# EasyEDA Pro project ProPrj_RS485 to TTL Converter_2026-02-25.epro

# Schematic Schematic1

## Sheets
1 Power Supply: Board Name: Board1; Create Date: 2026-02-10; Page Name: Power Supply; Project Name: RS485 to TTL Converter; Schematic Name: Schematic1; Update Date: 2026-02-10; Company: EasyEDA.com; Page Size: A4; Version: V1.0
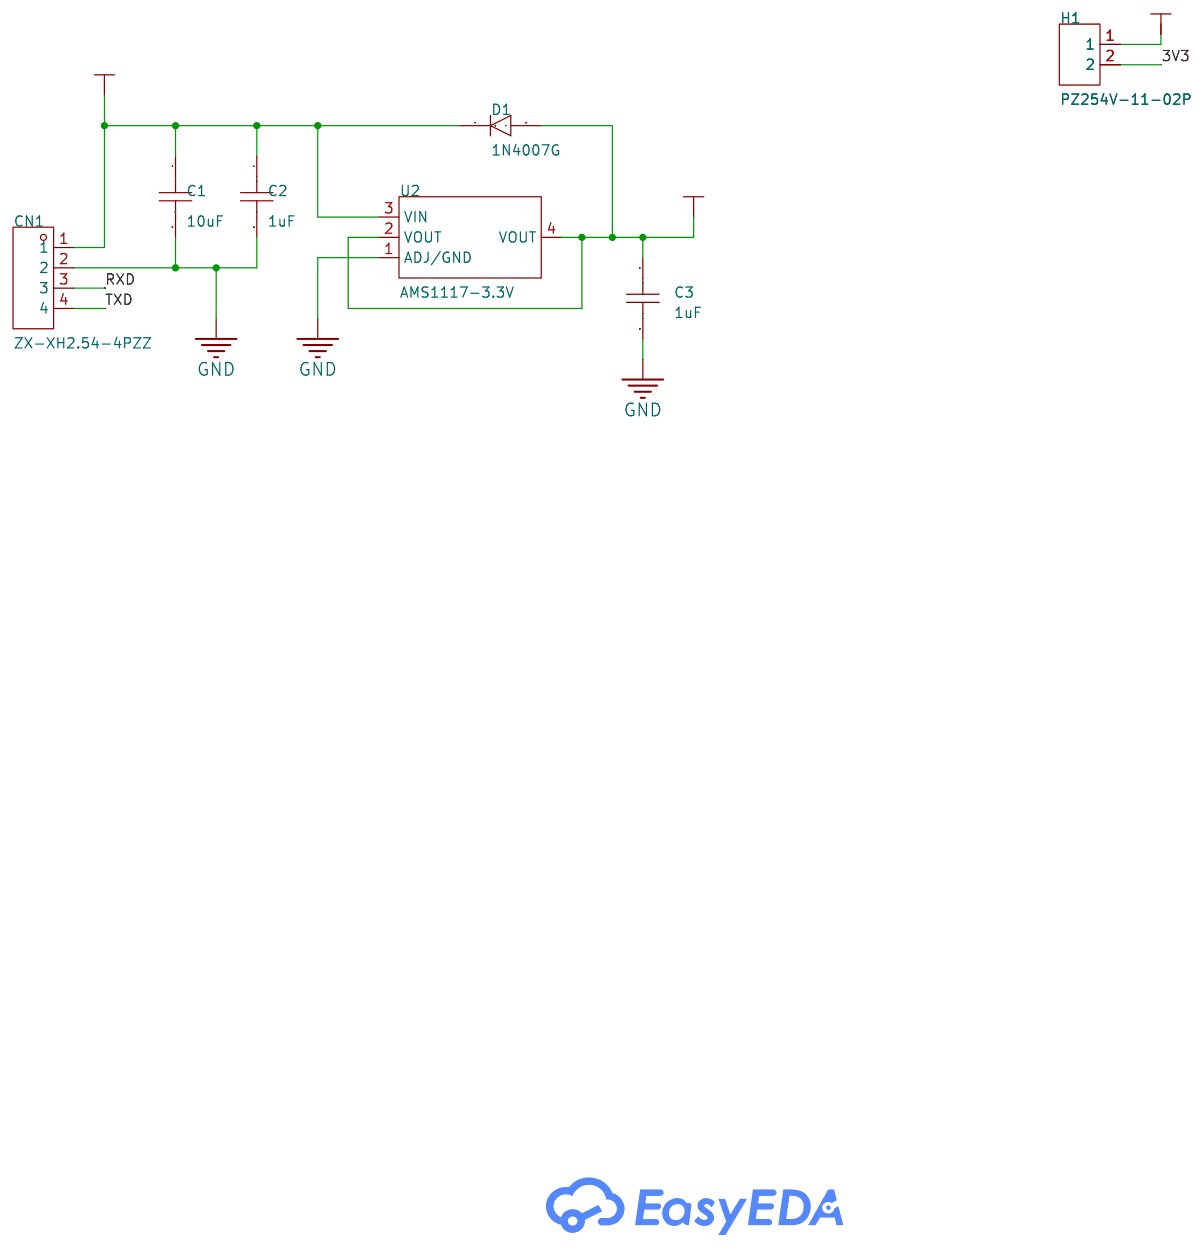
[diagram p0: Power Supply]
2 RS485: Page Name: RS485
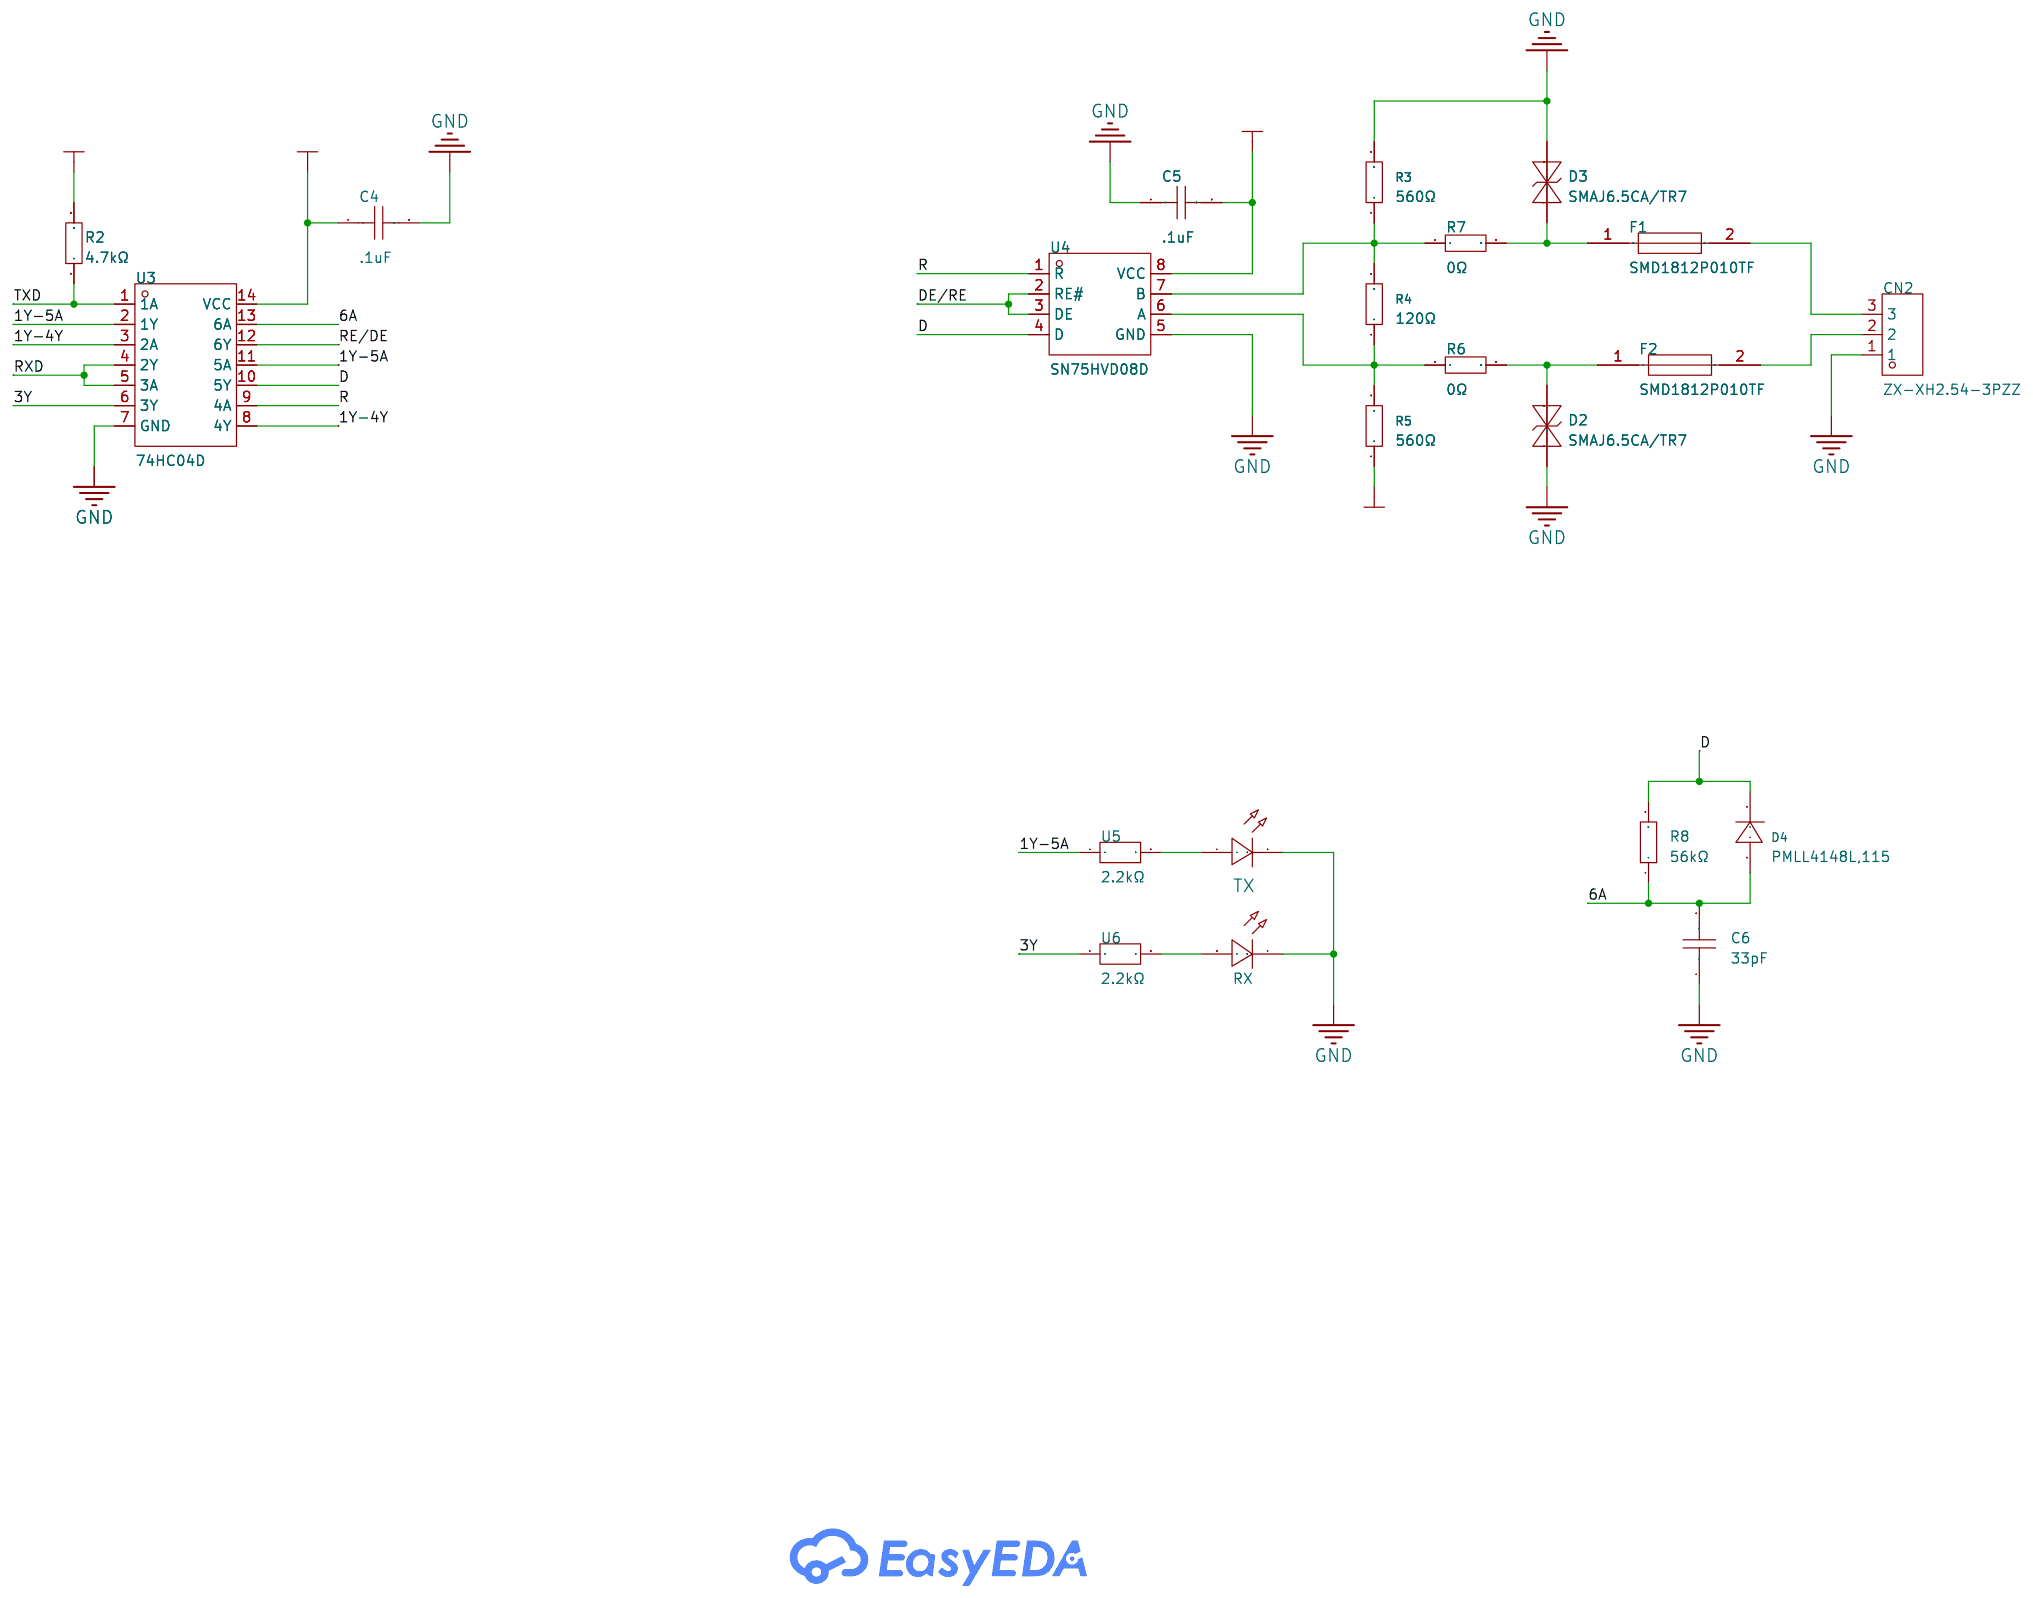
[diagram p1: RS485]

## Parts
sheet Power Supply
C1  10uF  [C0603]
C2  1uF  [C0603]
C3  1uF  [C0603]
CN1  ZX-XH2.54-4PZZ  [CONN-TH_4P-P2.50_4PIN]
D1  1N4007G  [SMA_L4.4-W2.6-LS5.0-RD]
H1  PZ254V-11-02P  [HDR-TH_2P-P2.54-V-M]
U2  AMS1117-3.3V  [SOT-223-4_L6.5-W3.5-P2.30-LS7.0-BR]
sheet RS485
C4  .1uF  [C0603]
C5  .1uF  [C0603]
C6  33pF  [C0603]
CN2  ZX-XH2.54-3PZZ  [CONN-TH_3P-P2.54_2501S-3P]
D2  SMAJ6.5CA/TR7  [SMA_L4.3-W2.6-LS5.1-BI]
D3  SMAJ6.5CA/TR7  [SMA_L4.3-W2.6-LS5.1-BI]
D4  PMLL4148L,115  [SOD-80_L3.5-W1.5-RD]
F1  SMD1812P010TF  [F1812]
F2  SMD1812P010TF  [F1812]
R2  4.7kΩ  [R0805]
R3  560Ω  [R0805]
R4  120Ω  [R0805]
R5  560Ω  [R0805]
R6  0Ω  [R0805]
R7  0Ω  [R0805]
R8  56kΩ  [R0805]
RX  -  [LED0603-RD_GREEN]
TX  -  [LED0603-R-RD]
U3  74HC04D  [SOP-14_L8.6-W3.9-P1.27-LS6.0-BL]
U4  SN75HVD08D  [SOIC-8_L4.9-W3.9-P1.27-LS6.0-BL]
U5  2.2kΩ  [R0805]
U6  2.2kΩ  [R0805]

## Library data of the parts
C1-C6 = CAP_0603: Supplier Footprint: 0603
CN1 = ZX-XH2.54-4PZZ: Pins Structure:1x4P Pitch:2.5mm Mounting Type:Through Hole Reference Series:XH Number of Pins:4P Number of Rows:1 Number of PINs Per Row:4 Row Spacing:- Current Rating:3A Contact Material:Brass Contact Plating:Tin Operating Temperature:-25℃~+85℃ Operating; LCSC Part Name: 1x4P 间距:2.5mm 直插 系列:XH; Supplier Part: C7429634; Manufacturer: Megastar(兆星); Supplier Footprint: 插件,P=2.5mm; JLCPCB Part Class: Extended Part; Datasheet: https://item.szlcsc.com/datasheet/ZX-XH2.54-4PZZ/8427551.html; Supplier: LCSC; Pins Structure: 1x4P; Pitch: 2.5mm; Mounting Type: Through Hole; Reference Series: XH; Number of Pins: 4P; Number of Rows: 1; Number of PINs Per Row: 4; Current Rating: 3A; Contact Material: Brass; Contact Plating: Tin; Operating Temperature: -25℃~+85℃; Voltage Rating: 250V; Plastic Material: PA66; Flame Retardant Rating: UL94V-0; Color: White; Z-Height of the Board: 7mm; X-Length of Bottom Edge on Board (Spacing Line): 12.5mm; Y-Width of Bottom Edge on Board: 5.9mm
D1 = 1N4007G_C111122: Diode Configuration:Independent Voltage - Forward(Vf@If):1.1V@1A Voltage - DC Reverse(Vr):1kV Current - Rectified:1A Reverse Leakage Current (Ir):5uA@1kV; LCSC Part Name: 丝印M7 1kV 1A; Supplier Part: C111122; Manufacturer: SHIKUES(时科); Supplier Footprint: SMA(DO-214AC); JLCPCB Part Class: Extended Part; Datasheet: https://item.szlcsc.com/datasheet/1N4007G/112348.html; Supplier: LCSC; Diode Configuration: Independent; Voltage - Forward(Vf@If): 1.1V@1A; Voltage - DC Reverse(Vr): 1kV; Current - Rectified: 1A; Reverse Leakage Current (Ir): 5uA@1kV
H1 = PZ254V-11-02P: Pin Structure:1x2P Pitch:2.54mm Row Spacing:- Circluar Pins/Square Pins:Pin Header Mounting Type:Through Hole Number of Rows:1 Number of Pins:2P Current Rating:- Voltage Rating (Max):- Length of Mating Pin:6mm Insulation Height:2.5mm Length of End Connect; LCSC Part Name: 1x2P 间距:2.54mm 方针 直插; Supplier Part: C492401; Manufacturer: XFCN(兴飞); Supplier Footprint: 插件,P=2.54mm; JLCPCB Part Class: Extended Part; Datasheet: https://item.szlcsc.com/datasheet/PZ254V-11-02P/502957.html; Supplier: LCSC; Pin Structure: 1x2P; Pitch: 2.54mm; Circluar Pins/Square Pins: Pin Header; Mounting Type: Through Hole; Number of Rows: 1; Number of Pins: 2P; Length of Mating Pin: 6mm; Insulation Height: 2.5mm; Length of End Connection Pin: 3mm; Contact Material: Brass; Operating Temperature: -40℃~+105℃; Color: Black
U2 = AMS1117-3.3V_C2688239: Output Type:Fixed Voltage - Supply:12V Output Voltage:3.3V Output Voltage:3.3V Output Current:1A Power Supply Rejection Ratio (PSRR):70dB@(120Hz) Voltage Dropout:1.4V@(1A) standby current:5mA Noise:0.003%Vout Features:Over Temperature Protection；Thermal S; LCSC Part Name: 输入20V 输出3.3V 1A; Supplier Part: C2688239; Manufacturer: WPMtek(维攀); Supplier Footprint: SOT-223-3L; JLCPCB Part Class: Extended Part; Datasheet: https://item.szlcsc.com/datasheet/AMS1117-3.3V/2793377.html; Supplier: LCSC; Output Type: Fixed; Voltage - Supply: 12V; Output Voltage: 3.3V; Output Current: 1A; Power Supply Rejection Ratio (PSRR): 70dB@(120Hz); Voltage Dropout: 1.4V@(1A); standby current: 5mA; Noise: 0.003%Vout; Features: Over Temperature Protection；Thermal Shutdown; Operating Temperature: -40℃~+125℃@(Tj); Output Configuration: Positive; Number of Outputs: 1
CN2 = ZX-XH2.54-3PZZ: Pins Structure:1x3P Pitch:2.5mm Mounting Type:Through Hole Reference Series:XH Number of Pins:3P Number of Rows:1 Number of PINs Per Row:3 Row Spacing:- Current Rating:3A Contact Material:Brass Contact Plating:Tin Operating Temperature:-25℃~+85℃ Operating; LCSC Part Name: 1x3P 间距:2.5mm 直插 系列:XH; Supplier Part: C7429633; Manufacturer: Megastar(兆星); Supplier Footprint: 插件,P=2.5mm; JLCPCB Part Class: Extended Part; Datasheet: https://item.szlcsc.com/datasheet/ZX-XH2.54-3PZZ/8427550.html; Supplier: LCSC; Pins Structure: 1x3P; Pitch: 2.5mm; Mounting Type: Through Hole; Reference Series: XH; Number of Pins: 3P; Number of Rows: 1; Number of PINs Per Row: 3; Current Rating: 3A; Contact Material: Brass; Contact Plating: Tin; Operating Temperature: -25℃~+85℃; Voltage Rating: 250V; Plastic Material: PA66; Flame Retardant Rating: UL94V-0; Color: White; Z-Height of the Board: 7mm; X-Length of Bottom Edge on Board (Spacing Line): 10mm; Y-Width of Bottom Edge on Board: 5.9mm
D2 D3 = SMAJ6.5CA/TR7: Polarity:Bidirectional Reverse Stand-Off Voltage (Vrwm):6.5V Clamping Voltage:11.2V Peak Pulse Current (Ipp):35.7A Peak Pulse Power Dissipation (Ppp):400W Voltage - Breakdown:7.22V Reverse Leakage Current (Ir):500uA Type:TVS; LCSC Part Name: 双向TVS 6.5V截止 35.7A峰值脉冲; Supplier Part: C3036084; Manufacturer: Brightking(君耀电子); Supplier Footprint: SMA(DO-214AC); JLCPCB Part Class: Extended Part; Datasheet: https://item.szlcsc.com/datasheet/SMAJ6.5CA%252FTR7/3585392.html; Supplier: LCSC; Polarity: Bidirectional; Reverse Stand-Off Voltage (Vrwm): 6.5V; Clamping Voltage: 11.2V; Peak Pulse Current (Ipp): 35.7A; Peak Pulse Power Dissipation (Ppp): 400W; Voltage - Breakdown: 7.22V; Reverse Leakage Current (Ir): 500uA; Type: TVS
D4 = PMLL4148L,115: Diode Configuration:Independent Voltage - Forward(Vf@If):1V@50mA Voltage - DC Reverse(Vr):75V Current - Rectified:200mA Pd - Power Dissipation:500mW Reverse Leakage Current (Ir):25nA@20V Reverse Recovery Time (trr):4ns Operating Junction Temperature Range; LCSC Part Name: 75V 200mA; Supplier Part: C78613; Manufacturer: Nexperia(安世); Supplier Footprint: MiniMELF; JLCPCB Part Class: Extended Part; Datasheet: https://item.szlcsc.com/datasheet/PMLL4148L%252C115/79749.html; Supplier: LCSC; Diode Configuration: Independent; Voltage - Forward(Vf@If): 1V@50mA; Voltage - DC Reverse(Vr): 75V; Current - Rectified: 200mA; Pd - Power Dissipation: 500mW; Reverse Leakage Current (Ir): 25nA@20V; Reverse Recovery Time (trr): 4ns; Non-Repetitive Peak Forward Surge Current: 4A
F1 F2 = SMD1812P010TF_C495355: Voltage - Max:30V Current - Max:100A Hold Current:100mA Trip Current:300mA Power Dissipation:800mW Resistance - Initial (Ri) (Min):1.6Ω Resistance - Post Trip (R1) (Max):15Ω Time to Trip(Max):1.5s Operating Temperature:-40℃~+85℃ Operating Temperature:-40℃; LCSC Part Name: 30V 100mA 1812自恢复; Supplier Part: C495355; Manufacturer: PTTC(聚鼎); Supplier Footprint: 1812; JLCPCB Part Class: Extended Part; Datasheet: https://item.szlcsc.com/datasheet/SMD1812P010TF/506516.html; Supplier: LCSC; Voltage - Max: 30V; Current - Max: 100A; Hold Current: 100mA; Trip Current: 300mA; Power Dissipation: 800mW; Resistance - Initial (Ri) (Min): 1.6Ω; Resistance - Post Trip (R1) (Max): 15Ω; Time to Trip(Max): 1.5s; Operating Temperature: -40℃~+85℃; Length: 4.73mm; Width: 3.41mm; Height: 1.25mm
R2 = 0805W8F4701T5E: Type:Thick Film Resistors Resistance:4.7kΩ Tolerance:±1% Tolerance:±1% Power(Watts): Overload Voltage (Max): Temperature Coefficient:±100ppm/℃ Temperature Coefficient:±100ppm/℃ Operating Temperature Range:-55℃~+155℃ Operating Temperature Range:-55℃~+155℃; LCSC Part Name: 4.7kΩ ±1% 125mW 厚膜电阻; Supplier Part: C17673; Manufacturer: UNI-ROYAL(厚声); Supplier Footprint: 0805; JLCPCB Part Class: Basic Part; Datasheet: https://atta.szlcsc.com/upload/public/pdf/source/20200306/C422600_1E6D84923E4A46A82E41ADD87F860B5C.pdf; Supplier: LCSC; Type: Thick Film Resistors; Tolerance: ±1%; Temperature Coefficient: ±100ppm/℃; Operating Temperature Range: -55℃~+155℃
R3 R5 = 0805W8F5600T5E: Type:Thick Film Resistors Resistance: Tolerance:±1% Tolerance:±1% Power(Watts): Overload Voltage (Max): Temperature Coefficient:±100ppm/℃ Temperature Coefficient:±100ppm/℃ Operating Temperature Range:-55℃~+155℃ Operating Temperature Range:-55℃~+155℃; LCSC Part Name: 560Ω ±1% 125mW 厚膜电阻; Supplier Part: C28636; Manufacturer: UNI-ROYAL(厚声); Supplier Footprint: 0805; JLCPCB Part Class: Basic Part; Datasheet: https://atta.szlcsc.com/upload/public/pdf/source/20200306/C422600_1E6D84923E4A46A82E41ADD87F860B5C.pdf; Supplier: LCSC; Type: Thick Film Resistors; Tolerance: ±1%; Temperature Coefficient: ±100ppm/℃; Operating Temperature Range: -55℃~+155℃
R4 = 0805W8F1200T5E: Type:Thick Film Resistors Resistance: Tolerance:±1% Tolerance:±1% Power(Watts): Overload Voltage (Max): Temperature Coefficient:±100ppm/℃ Temperature Coefficient:±100ppm/℃ Operating Temperature Range:-55℃~+155℃ Operating Temperature Range:-55℃~+155℃; LCSC Part Name: 120Ω ±1% 125mW 厚膜电阻; Supplier Part: C17437; Manufacturer: UNI-ROYAL(厚声); Supplier Footprint: 0805; JLCPCB Part Class: Basic Part; Datasheet: https://atta.szlcsc.com/upload/public/pdf/source/20200306/C422600_1E6D84923E4A46A82E41ADD87F860B5C.pdf; Supplier: LCSC; Type: Thick Film Resistors; Tolerance: ±1%; Temperature Coefficient: ±100ppm/℃; Operating Temperature Range: -55℃~+155℃
R6 R7 = 0805W8F0000T5E_C17477: Type:Thick Film Resistor Resistance:0Ω Tolerance:±1% Tolerance:±1% Power(Watts):125mW Voltage-Supply(Max):150V Temperature Coefficient:±800ppm/℃ Temperature Coefficient:±800ppm/℃ Operating Temperature:-55℃~+155℃ Operating Temperature:-55℃~+155℃; LCSC Part Name: 0Ω ±1% 125mW 厚膜电阻; Supplier Part: C17477; Manufacturer: UNI-ROYAL(厚声); Manufacturer Part: 0805W8F0000T5E; Supplier Footprint: 0805; JLCPCB Part Class: Basic Part; Datasheet: https://item.szlcsc.com/datasheet/0805W8F0000T5E/18165.html; Supplier: LCSC; Type: Thick Film Resistor; Tolerance: ±1%; Power(Watts): 125mW; Voltage-Supply(Max): 150V; Temperature Coefficient: ±800ppm/℃; Operating Temperature: -55℃~+155℃
R8 = 0805W8F5602T5E: Type:Thick Film Resistor Resistance:56kΩ Tolerance:±1% Tolerance:±1% Power(Watts):125mW Voltage-Supply(Max):150V Temperature Coefficient:±100ppm/℃ Temperature Coefficient:±100ppm/℃ Operating Temperature:-55℃~+155℃ Operating Temperature:-55℃~+155℃; LCSC Part Name: 56kΩ ±1% 125mW 厚膜电阻; Supplier Part: C17756; Manufacturer: UNI-ROYAL(厚声); Supplier Footprint: 0805; JLCPCB Part Class: Extended Part; Datasheet: https://item.szlcsc.com/datasheet/0805W8F5602T5E/18444.html; Supplier: LCSC; Type: Thick Film Resistor; Tolerance: ±1%; Power(Watts): 125mW; Voltage-Supply(Max): 150V; Temperature Coefficient: ±100ppm/℃; Operating Temperature: -55℃~+155℃
RX = LED_0603-G
TX = LED_0603-R: Supplier Footprint: 0603
U3 = 74HC04D: LCSC Part Name: 停产 74HC04D; Supplier Part: C510568; Manufacturer: HTC; Supplier Footprint: SOP-14; JLCPCB Part Class: Extended Part; Datasheet: https://item.szlcsc.com/datasheet/74HC04D/524639.html; Supplier: LCSC
U4 = SN75HVD08D: Type:Transceiver Number of Drivers:1 Number of Receivers:1 Voltage - Supply:3V~5.5V Voltage - Supply:3V~5.5V Data Rate:10Mbps Data Rate:10Mbps Operating Temperature:0℃~+70℃ Operating Temperature:0℃~+70℃; LCSC Part Name: SNx5HVD08 宽电源范围 RS-485 收发器 停产; Supplier Part: C1544007; Manufacturer: TI(德州仪器); Supplier Footprint: SOIC-8; JLCPCB Part Class: Extended Part; Datasheet: https://www.ti.com/cn/lit/gpn/sn75hvd08; Supplier: LCSC; Type: Transceiver; Number of Drivers: 1; Number of Receivers: 1; Voltage - Supply: 3V~5.5V; Data Rate: 10Mbps; Operating Temperature: 0℃~+70℃
U5 U6 = FRC0805J222 TS: Type:Thick Film Resistor Resistance:2.2kΩ Tolerance:±5% Tolerance:±5% Power(Watts):125mW Voltage-Supply(Max):150V Temperature Coefficient:±100ppm/℃ Temperature Coefficient:±100ppm/℃ Operating Temperature:-55℃~+155℃ Operating Temperature:-55℃~+155℃; LCSC Part Name: 2.2kΩ ±5% 125mW 厚膜电阻; Supplier Part: C2907303; Manufacturer: FOJAN(富捷); Supplier Footprint: 0805; JLCPCB Part Class: Extended Part; Supplier: LCSC; Type: Thick Film Resistor; Tolerance: ±5%; Power(Watts): 125mW; Voltage-Supply(Max): 150V; Temperature Coefficient: ±100ppm/℃; Operating Temperature: -55℃~+155℃

## Nets
3V3: C3.1 C4.1 C5.2 D1.2(A) H1.2 R2.2 R5.1 U2.2(VOUT) U2.4(VOUT) U3.14(VCC) U4.8(VCC)
5V: C1.1 C2.1 CN1.1 D1.1(C) H1.1 U2.3(VIN)
GND: C1.2 C2.2 C3.2 C4.2 C5.1 C6.1 CN1.2 CN2.1 D2.1 D3.2 R3.2 RX.1(C) TX.2(C) U2.1(ADJ/GND) U3.7(GND) U4.5(GND)
1Y-4Y: U3.3(2A) U3.8(4Y)
1Y-5A: U3.2(1Y) U3.11(5A) U5.1
3Y: U3.6(3Y) U6.1
6A: C6.2 D4.2(A) R8.1 U3.13(6A)
D: D4.1(K) R8.2 U3.10(5Y) U4.4(D)
DE/RE: U4.2(RE#) U4.3(DE)
R: U3.9(4A) U4.1(R)
RE/DE: U3.12(6Y)
RXD: CN1.3 U3.4(2Y) U3.5(3A)
TXD: CN1.4 R2.1 U3.1(1A)
$2N1058: R3.1 R4.2 R7.1 U4.7(B)
$2N1062: R4.1 R5.2 R6.1 U4.6(A)
$2N1369: D2.2 F2.1 R6.2
$2N1412: D3.1 F1.1 R7.2
$2N1716: CN2.3 F1.2
$2N1725: CN2.2 F2.2
$2N2307: TX.1(A) U5.2
$2N2311: RX.2(A) U6.2

# Board PCB1
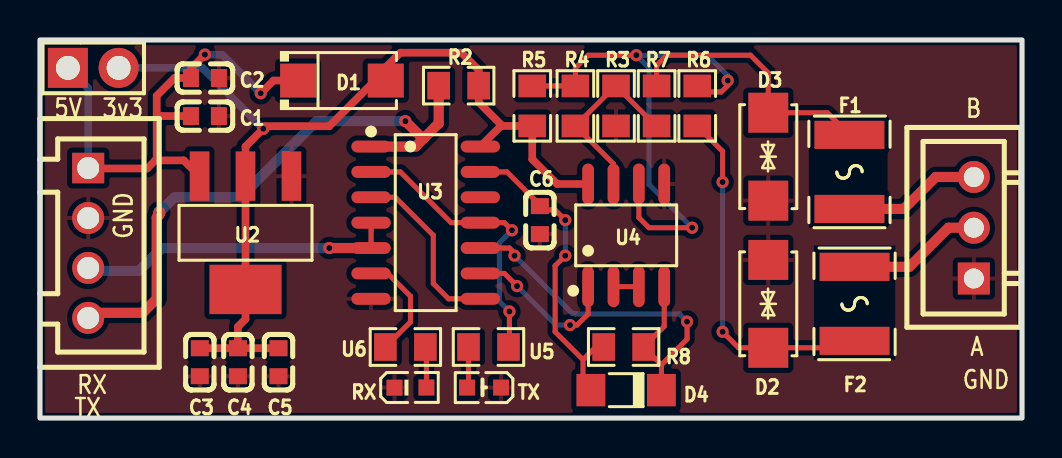
[diagram p2: board, top side]
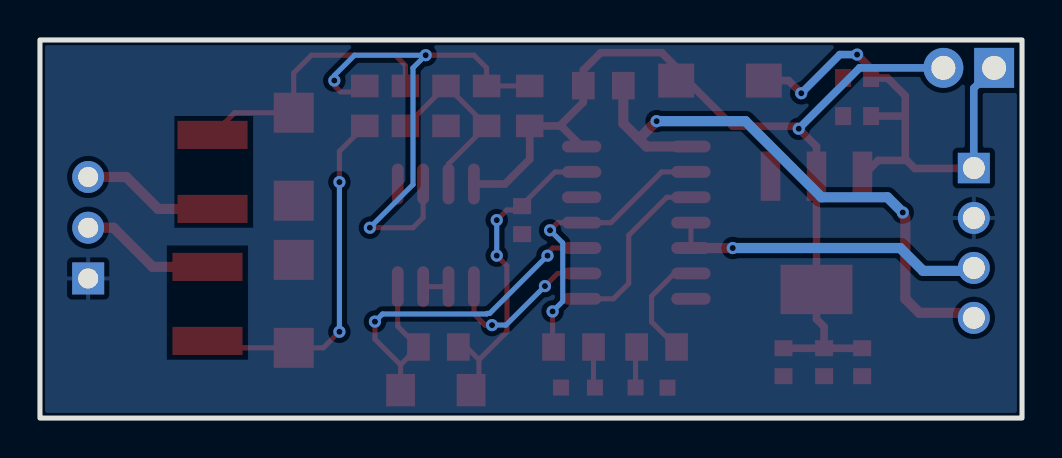
[diagram p3: board, bottom side, seen from below]

Outline 49.15 x 18.92 mm; copper layers: Top Layer, Bottom Layer. Coordinates in mm from the lower left corner of the outline.
Outline path: rectangle 0,18.92 49.15,0
Stack: Top Layer 0.035mm / Dielectric1 1.51mm FR4 er 4.5 / Bottom Layer 0.035mm

## Design rules (mm)
template: JLCPCB Capability(Two Layers Board)
spacing copperThickness1oz (default): track to track 0.102, other pairs 0.152 to 0.3
spacing copperThickness2oz: track to track 0.203, other pairs 0.152 to 0.3
track width copperThickness1oz (default): min 0.127, default 0.254, max 2.54
track width copperThickness2oz: min 0.203, default 0.254, max 2.54
differential pair differentialPair (default): width min 0.127, default 0.254, max 2.54; gap min 0.152, default 0.152
via viaSize (default): diameter min 0.5, default 0.61, max 10; hole min 0.3, default 0.305, max 6.3

## Placement (name value [footprint] x y rotation side)
C1  10uF  [C0603]  8.26 15.11 0 top
C2  1uF  [C0603]  8.26 17.02 0 top
C3  1uF  [C0603]  8 2.79 270 top
C4  .1uF  [C0603]  9.91 2.79 270 top
C5  .1uF  [C0603]  11.94 2.79 90 top
C6  33pF  [C0603]  25.02 9.91 90 top
CN1  ZX-XH2.54-4PZZ  [CONN-TH_4P-P2.50_4PIN]  2.41 8.76 270 top
CN2  ZX-XH2.54-3PZZ  [CONN-TH_3P-P2.54_2501S-3P]  46.74 9.53 90 top
D1  1N4007G  [SMA_L4.4-W2.6-LS5.0-RD]  15.11 16.89 0 top
D2  SMAJ6.5CA/TR7  [SMA_L4.3-W2.6-LS5.1-BI]  36.45 5.72 270 top
D3  SMAJ6.5CA/TR7  [SMA_L4.3-W2.6-LS5.1-BI]  36.45 13.08 270 top
D4  PMLL4148L,115  [SOD-80_L3.5-W1.5-RD]  29.34 1.4 180 top
F1  SMD1812P010TF  [F1812]  40.51 12.32 270 top
F2  SMD1812P010TF  [F1812]  40.77 5.72 90 top
H1  PZ254V-11-02P  [HDR-TH_2P-P2.54-V-M]  2.67 17.53 0 top
R2  4.7kΩ  [R0805]  20.95 16.64 0 top
R3  560Ω  [R0805]  28.83 15.62 270 top
R4  120Ω  [R0805]  26.8 15.62 270 top
R5  560Ω  [R0805]  24.64 15.62 90 top
R6  0Ω  [R0805]  32.89 15.62 270 top
R7  0Ω  [R0805]  30.86 15.62 90 top
R8  56kΩ  [R0805]  29.21 3.56 0 top
RX  -  [LED0603-RD_GREEN]  18.54 1.52 0 top
TX  -  [LED0603-R-RD]  22.23 1.52 180 top
U2  AMS1117-3.3V  [SOT-223-4_L6.5-W3.5-P2.30-LS7.0-BR]  10.29 9.27 90 top
U3  74HC04D  [SOP-14_L8.6-W3.9-P1.27-LS6.0-BL]  19.3 9.78 270 top
U4  SN75HVD08D  [SOIC-8_L4.9-W3.9-P1.27-LS6.0-BL]  29.34 9.14 0 top
U5  2.2kΩ  [R0805]  22.45 3.56 180 top
U6  2.2kΩ  [R0805]  18.29 3.56 0 top

## Footprints (pads in the part's own frame, mm; a bottom-side part is the same pattern mirrored in y, then rotated)
C0603
  rect 0.8x0.9 smd: 1(-0.7,0) 2(0.7,0)
CONN-TH_3P-P2.54_2501S-3P
  rect 1.6x1.6 hole 1: 1(-2.54,0)
  round 1.6 hole 1: 2(0,0) 3(2.54,0)
CONN-TH_4P-P2.50_4PIN
  rect 1.524x1.6 hole 1.1: 1(-3.75,0)
  round 1.6 hole 1.1: 2(-1.25,0) 3(1.25,0) 4(3.75,0)
F1812
  rect 1.407x3.499 smd: 1(-1.853,0) 2(1.853,0)
HDR-TH_2P-P2.54-V-M
  rect 2x2 hole 1.2: 1(-1.27,0)
  round 2 hole 1.2: 2(1.27,0)
LED0603-R-RD
  rect 0.8x0.8 smd: 1(0.851,0) 2(-0.851,0)
LED0603-RD_GREEN
  rect 0.8x0.8 smd: 1(-0.799,-0.004) 2(0.799,0.004)
R0805
  rect 1.133x1.377 smd: 1(-1,0) 2(1,0)
SMA_L4.3-W2.6-LS5.1-BI
  rect 2x2 smd: 1(-2.2,0) 2(2.2,0)
SMA_L4.4-W2.6-LS5.0-RD
  rect 1.8x1.7 smd: 1(-2.192,0) 2(2.192,0)
SOD-80_L3.5-W1.5-RD
  rect 1.44x1.62 smd: 1(-1.765,0) 2(1.765,0)
SOIC-8_L4.9-W3.9-P1.27-LS6.0-BL
  oval 0.588x2.045 smd: 1(-1.905,-2.57) 2(-0.635,-2.57) 3(0.635,-2.57) 4(1.905,-2.57) 5(1.905,2.57) 6(0.635,2.57) 7(-0.635,2.57) 8(-1.905,2.57)
SOP-14_L8.6-W3.9-P1.27-LS6.0-BL
  oval 0.595x1.968 smd: 1(-3.81,-2.734) 2(-2.54,-2.734) 3(-1.27,-2.734) 4(0,-2.734) 5(1.27,-2.734) 6(2.54,-2.734) 7(3.81,-2.734) 8(3.81,2.734) 9(2.54,2.734) 10(1.27,2.734) 11(0,2.734) 12(-1.27,2.734) 13(-2.54,2.734) 14(-3.81,2.734)
SOT-223-4_L6.5-W3.5-P2.30-LS7.0-BR
  rect 2.47x0.98 smd: 1(2.835,-2.3) 2(2.835,0) 3(2.835,2.3)
  rect 2.47x3.6 smd: 4(-2.835,0)

## Nets
As in the schematic.

## Via types
v1: diameter 0.61, hole 0.305, Top Layer to Bottom Layer, 19 vias

## Routing (per net, layer and track width the routed paths; a pad name or vN(x,y) marks a point on that pad's centre or on a via; arc(x,y) is an arc through that point)
3V3: length 48.6
  Top Layer w0.381: 16.76,16.89 14.48,14.61 11.3,14.61 10.29,13.59 U2.2 U2.4 10.29,4.95 9.91,4.57 9.91,3.49 ; 16.76,16.89 16.76,17.02 18.03,18.29 21.08,18.29 21.95,17.42 R2.2 21.95,15.81 23.14,14.62 ; 16.76,16.89 D1.2 ; 11.94,3.49 9.91,3.49 ; 9.91,3.49 8,3.49 ; 22.04,13.59 23.07,14.62 23.14,14.62 ; 23.14,14.62 R5.1 24.64,12.95 25.88,11.71 U4.8
  Bottom Layer w0.381: H1.2 8.13,17.53 v1(11.18,14.48)
5V: length 25.8
  Top Layer w0.381: C1.1 5.84,15.11 ; 5.84,15.11 5.84,16.13 6.73,17.02 C2.1 7.56,17.49 v1(8.26,18.19) ; 5.84,15.11 5.84,12.97 5.77,12.89 ; 2.54,12.89 2.94,12.49 5.37,12.49 5.77,12.89 ; 5.77,12.89 7.2,12.89 U2.3 ; D1.1 11.68,16.89 v1(11.05,16.26)
  Bottom Layer w0.381: H1.1 2.41,16.51 CN1.1 ; v1(11.05,16.26) 9.11,18.19 v1(8.26,18.19)
1Y-4Y: length 9
  Top Layer w0.254: 22.04,5.97 20.45,5.97 19.69,6.73 19.69,9.14 17.78,11.05 U3.3
1Y-5A: length 14.6
  Top Layer w0.254: v1(23.62,9.4) 23.24,9.78 20.57,9.78 18.03,12.32 U3.2 ; U5.1 23.5,3.6 v1(23.5,5.33)
  Bottom Layer w0.254: v1(23.5,5.33) 22.99,5.84 22.99,8.76 v1(23.62,9.4)
3Y: length 5.5
  Top Layer w0.254: U6.1 18.54,4.81 18.54,6.1 17.4,7.24 U3.6
6A: length 16
  Top Layer w0.254: v1(26.29,8.13) 25.78,7.62 25.78,4.32 27.18,2.92 ; D4.2 27.18,1.79 27.18,2.92 ; 22.04,12.32 23.37,12.32 25.02,10.67 C6.2 25.21,10.41 25.78,10.41 v1(26.29,9.91) ; 27.18,2.92 27.81,3.56 R8.1
  Bottom Layer w0.254: v1(26.29,9.91) v1(26.29,8.13)
D: length 20.6
  Top Layer w0.254: 31.1,2.66 R8.2 31.24,4.59 31.24,6.57 ; 31.1,2.66 32.39,3.95 v1(32.39,4.83) ; 31.1,2.66 D4.1 ; v1(23.75,8.13) 23.75,8.26 23.5,8.51 22.04,8.51
  Bottom Layer w0.254: v1(32.39,4.83) 32,5.21 26.8,5.21 26.77,5.24 26.64,5.24 v1(23.75,8.13)
DE/RE: length 1.3
  Top Layer w0.254: 29.97,6.57 28.7,6.57
R: length 8.1
  Top Layer w0.254: v1(23.88,6.6) 23.24,7.24 22.04,7.24 ; v1(26.53,4.65) 26.88,4.65 27.43,5.21 27.43,6.57
  Bottom Layer w0.254: v1(23.88,6.6) 25.83,4.65 v1(26.53,4.65)
RXD: length 16
  Top Layer w0.254: U3.4 U3.5
  Top Layer w0.508: U3.5 v1(14.48,8.51)
  Bottom Layer w0.508: 2.54,7.89 3.07,7.37 4.95,7.37 6.1,8.51 v1(14.48,8.51)
TXD: length 28.7
  Top Layer w0.508: 19.2,13.99 19.95,14.75 19.95,16.13 ; 19.2,13.99 19.16,13.99 v1(18.29,14.86) ; 19.2,13.99 18.8,13.59 U3.1 ; v1(5.97,10.29) 5.97,10.16 5.84,10.03 5.84,5.97 5.14,5.27 2.67,5.27 2.54,5.39
  Bottom Layer w0.508: v1(18.29,14.86) 13.84,14.86 10.03,11.05 6.73,11.05 v1(5.97,10.29)
$2N1058: length 9.4
  Top Layer w0.254: R7.1 30.83,14.62 R3.1 28.8,16.62 R4.2 28.7,12.72 U4.7
$2N1062: length 28
  Top Layer w0.254: U4.6 29.97,10.03 30.48,9.53 v1(32.64,9.53) ; v1(29.85,18.16) 27.43,18.16 26.8,17.53 R4.1 R5.2 ; R6.1 32.89,16.58 33.15,16.32 34.1,16.32 34.42,16.64 v1(34.42,16.89)
  Bottom Layer w0.254: v1(34.42,16.89) 34.42,17.15 33.4,18.16 v1(29.85,18.16) 30.48,17.53 30.48,11.68 v1(32.64,9.53)
$2N1369: length 17.9
  Top Layer w0.254: R6.2 34.16,13.35 v1(34.16,11.81) ; F2.1 40.42,3.52 D2.2 34.97,3.52 v1(34.16,4.32)
  Bottom Layer w0.254: v1(34.16,11.81) v1(34.16,4.32)
$2N1412: length 13.7
  Top Layer w0.254: F1.1 39.4,15.28 D3.1 36.45,17.27 35.56,18.16 31.37,18.16 30.86,17.65 R7.2
$2N1716: length 6.9
  Top Layer w0.508: F1.2 43.23,10.47 44.83,12.06 CN2.3
$2N1725: length 6.8
  Top Layer w0.508: F2.2 43.51,7.57 45.47,9.53 CN2.2
$2N2307: length 2.1
  Top Layer w0.254: TX.1 21.45,1.6 U5.2
$2N2311: length 2.1
  Top Layer w0.254: U6.2 19.34,3.5 RX.2

## Copper pours and planes (outline as drawn; the poured copper is in the pictures)
GND on Top Layer: -5.46,21.97 51.31,21.97 51.31,-1.91 -5.46,-1.91
GND on Bottom Layer: -2.92,21.97 51.05,21.97 51.05,-1.4 -2.92,-1.4

## Text on the board
Top Silkscreen Layer: 5V | TX | RX | 3v3 | GND | B | A
